# Altium schematic sheet Peripheral.SchDoc
size A4; SheetNumber: 5; SheetTotal: 6; ProjectTitle: DSP_VERSION_1.0
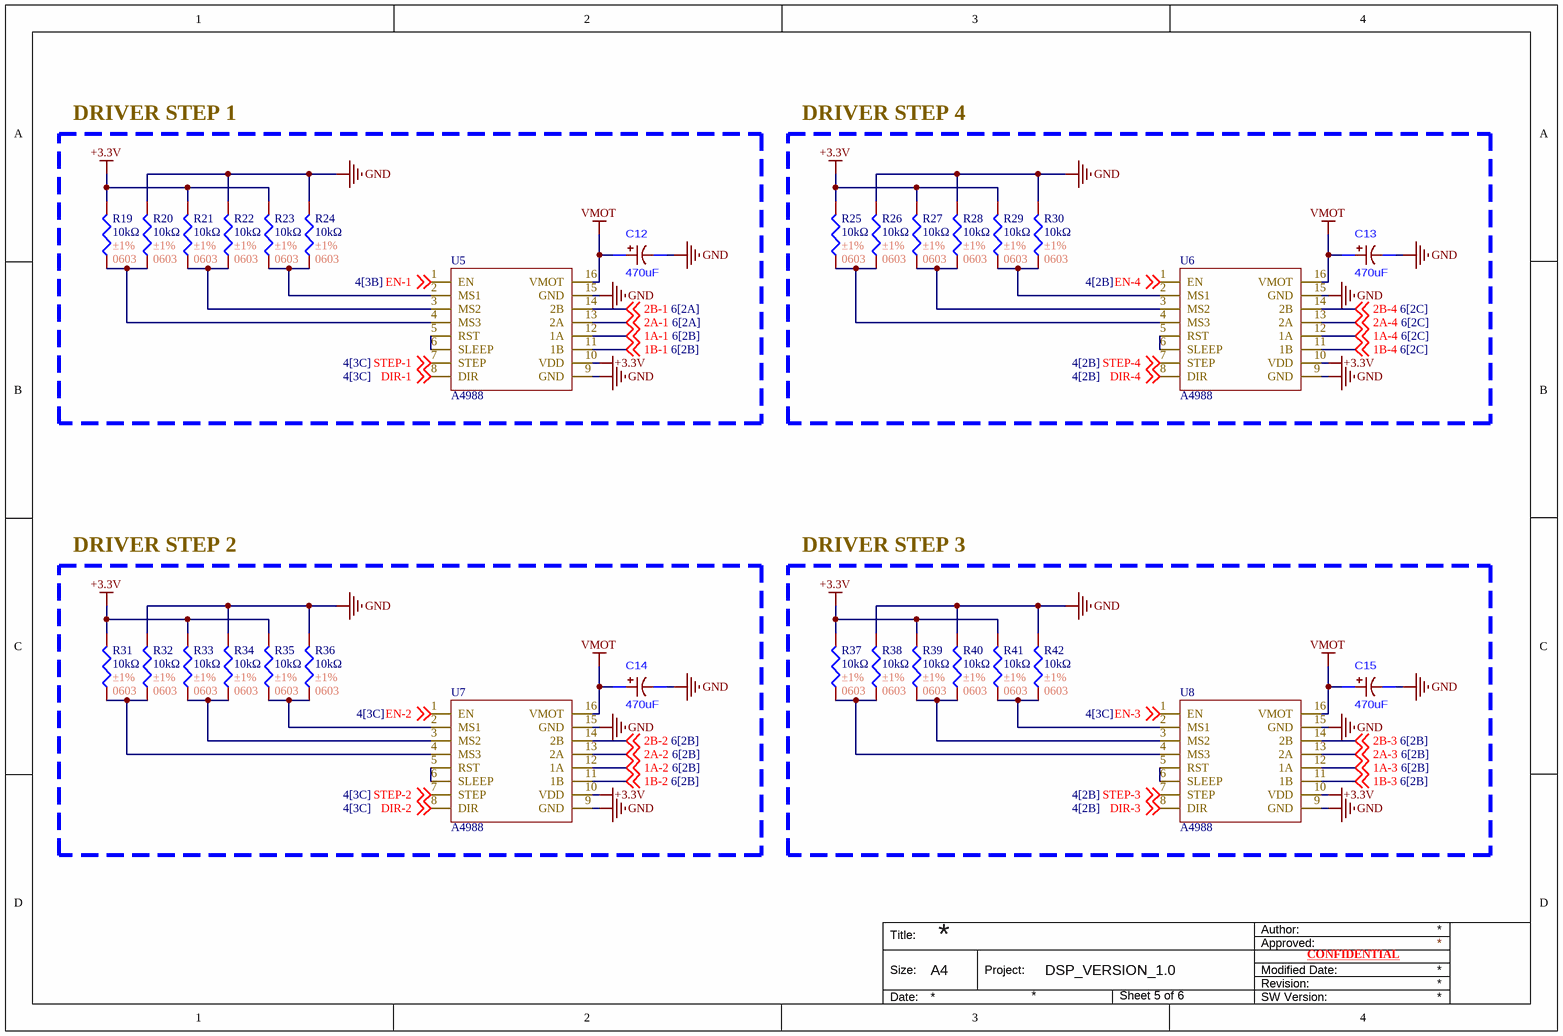
[diagram p0: Peripheral.SchDoc]

## Parts
C12  470uF  [470uF 35V, D10xL13mm]
C13  470uF  [470uF 35V, D10xL13mm]
C14  470uF  [470uF 35V, D10xL13mm]
C15  470uF  [470uF 35V, D10xL13mm]
R19  10kΩ  Tolerance: ±1%  Package: 0603  [R0603]
R20  10kΩ  Tolerance: ±1%  Package: 0603  [R0603]
R21  10kΩ  Tolerance: ±1%  Package: 0603  [R0603]
R22  10kΩ  Tolerance: ±1%  Package: 0603  [R0603]
R23  10kΩ  Tolerance: ±1%  Package: 0603  [R0603]
R24  10kΩ  Tolerance: ±1%  Package: 0603  [R0603]
R25  10kΩ  Tolerance: ±1%  Package: 0603  [R0603]
R26  10kΩ  Tolerance: ±1%  Package: 0603  [R0603]
R27  10kΩ  Tolerance: ±1%  Package: 0603  [R0603]
R28  10kΩ  Tolerance: ±1%  Package: 0603  [R0603]
R29  10kΩ  Tolerance: ±1%  Package: 0603  [R0603]
R30  10kΩ  Tolerance: ±1%  Package: 0603  [R0603]
R31  10kΩ  Tolerance: ±1%  Package: 0603  [R0603]
R32  10kΩ  Tolerance: ±1%  Package: 0603  [R0603]
R33  10kΩ  Tolerance: ±1%  Package: 0603  [R0603]
R34  10kΩ  Tolerance: ±1%  Package: 0603  [R0603]
R35  10kΩ  Tolerance: ±1%  Package: 0603  [R0603]
R36  10kΩ  Tolerance: ±1%  Package: 0603  [R0603]
R37  10kΩ  Tolerance: ±1%  Package: 0603  [R0603]
R38  10kΩ  Tolerance: ±1%  Package: 0603  [R0603]
R39  10kΩ  Tolerance: ±1%  Package: 0603  [R0603]
R40  10kΩ  Tolerance: ±1%  Package: 0603  [R0603]
R41  10kΩ  Tolerance: ±1%  Package: 0603  [R0603]
R42  10kΩ  Tolerance: ±1%  Package: 0603  [R0603]
U5  A4988  [A4988-driver_step]
U6  A4988  [A4988-driver_step]
U7  A4988  [A4988-driver_step]
U8  A4988  [A4988-driver_step]

## Nets
+3.3V: R19.2 R21.2 R23.2 R25.2 R27.2 R29.2 R31.2 R33.2 R35.2 R37.2 R39.2 R41.2 U5.10(VDD) U6.10(VDD) U7.10(VDD) U8.10(VDD)
GND: C12.2 C13.2 C14.2 C15.2 R20.2 R22.2 R24.2 R26.2 R28.2 R30.2 R32.2 R34.2 R36.2 R38.2 R40.2 R42.2 U5.9(GND) U5.15(GND) U6.9(GND) U6.15(GND) U7.9(GND) U7.15(GND) U8.9(GND) U8.15(GND)
VMOT: C12.1 C13.1 C14.1 C15.1 U5.16(VMOT) U6.16(VMOT) U7.16(VMOT) U8.16(VMOT)
1A-1: U5.12(1A) ; off-sheet 1A-1
1A-2: U7.12(1A) ; off-sheet 1A-2
1A-3: U8.12(1A) ; off-sheet 1A-3
1A-4: U6.12(1A) ; off-sheet 1A-4
1B-1: U5.11(1B) ; off-sheet 1B-1
1B-2: U7.11(1B) ; off-sheet 1B-2
1B-3: U8.11(1B) ; off-sheet 1B-3
1B-4: U6.11(1B) ; off-sheet 1B-4
2A-1: U5.13(2A) ; off-sheet 2A-1
2A-2: U7.13(2A) ; off-sheet 2A-2
2A-3: U8.13(2A) ; off-sheet 2A-3
2A-4: U6.13(2A) ; off-sheet 2A-4
2B-1: U5.14(2B) ; off-sheet 2B-1
2B-2: U7.14(2B) ; off-sheet 2B-2
2B-3: U8.14(2B) ; off-sheet 2B-3
2B-4: U6.14(2B) ; off-sheet 2B-4
DIR-1: U5.8(DIR) ; off-sheet DIR-1
DIR-2: U7.8(DIR) ; off-sheet DIR-2
DIR-3: U8.8(DIR) ; off-sheet DIR-3
DIR-4: U6.8(DIR) ; off-sheet DIR-4
EN-1: U5.1(EN) ; off-sheet EN-1
EN-2: U7.1(EN) ; off-sheet EN-2
EN-3: U8.1(EN) ; off-sheet EN-3
EN-4: U6.1(EN) ; off-sheet EN-4
STEP-1: U5.7(STEP) ; off-sheet STEP-1
STEP-2: U7.7(STEP) ; off-sheet STEP-2
STEP-3: U8.7(STEP) ; off-sheet STEP-3
STEP-4: U6.7(STEP) ; off-sheet STEP-4
NetR19_1: R19.1 R20.1 U5.4(MS3)
NetR21_1: R21.1 R22.1 U5.3(MS2)
NetR23_1: R23.1 R24.1 U5.2(MS1)
NetR25_1: R25.1 R26.1 U6.4(MS3)
NetR27_1: R27.1 R28.1 U6.3(MS2)
NetR29_1: R29.1 R30.1 U6.2(MS1)
NetR31_1: R31.1 R32.1 U7.4(MS3)
NetR33_1: R33.1 R34.1 U7.3(MS2)
NetR35_1: R35.1 R36.1 U7.2(MS1)
NetR37_1: R37.1 R38.1 U8.4(MS3)
NetR39_1: R39.1 R40.1 U8.3(MS2)
NetR41_1: R41.1 R42.1 U8.2(MS1)
NetU5_5: U5.5(RST) U5.6(SLEEP)
NetU6_5: U6.5(RST) U6.6(SLEEP)
NetU7_5: U7.5(RST) U7.6(SLEEP)
NetU8_5: U8.5(RST) U8.6(SLEEP)

## Notes on the sheet
- DRIVER STEP 1
- DRIVER STEP 4
- DRIVER STEP 2
- DRIVER STEP 3
- Author:
- Title:
- Size:
- A4
- Project:
- Approved:
- Revision:
- Modified Date:
- CONFIDENTIAL
- Date:
- SW Version:

## Library data of the parts
C12-C15 = 470uF  35V, D10xL13mm: 470uF ±20% 35V Through Hole,D10xL13mm; Manufacturer: AISHI; Mfr. Part #: SPZ1VM471G13O00RAXXX; Key Attributes: CAP ALUM POLY 470uF ±20% 35V TH; LCSC Part #: C2691847; Package: Through Hole,D10xL13mm; Link: https://www.lcsc.com/product-detail/C2691847.html
R19-R42 = R0603_10kΩ_±1%: 62.5mW Thick Film Resistor 50V ±1% ±200ppm/℃ 10Ω 0402 Chip Resistor - Surface Mount ROHS; Manufacturer: YAGEO; Mfr. Part #: RC0402FR-0710RL; LCSC Part #: C138066; Resistance: 10kΩ; Link: https://www.lcsc.com/product-detail/C138066.html?s_z=n_resistor%25200402%252010R
U5-U8 = Module_A4988